# EAGLE schematic pir-sensors-with-esp (EAGLE 9.3.0)
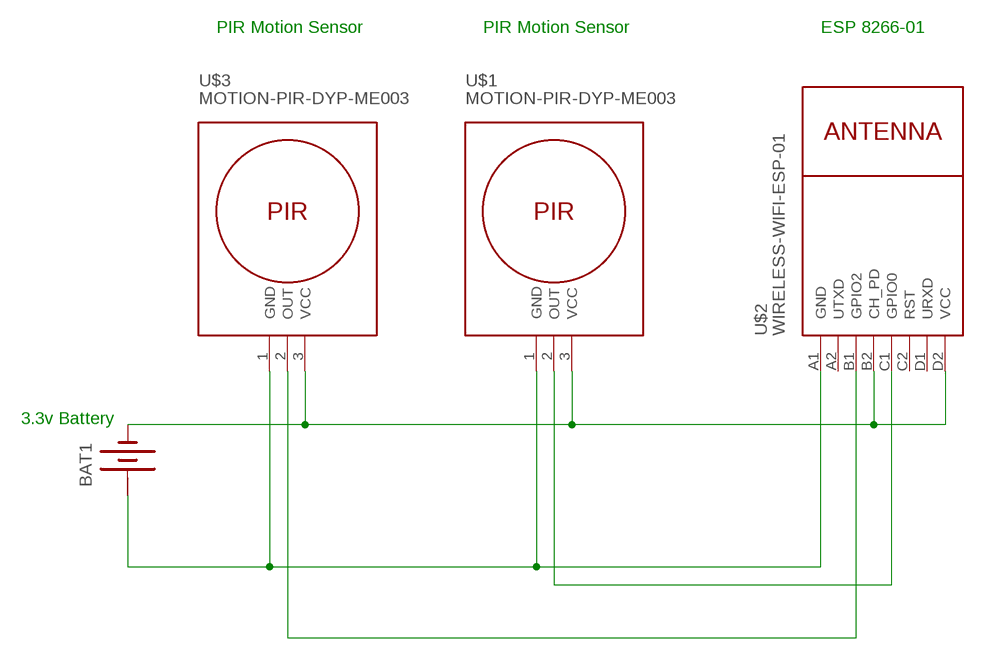
[diagram p0: schematic, sheet 1]

## Parts
BAT1  BATTERY  [BATTERY]
U$1  MOTION-PIR-DYP-ME003  [MOTION-PIR-DYP-ME003]
U$2  WIRELESS-WIFI-ESP-01  [WIRELESS-WIFI-ESP-01]
U$3  MOTION-PIR-DYP-ME003  [MOTION-PIR-DYP-ME003]

## Nets
N$1: U$2.B1(GPIO2) U$3.2(OUT)
N$2: U$1.2(OUT) U$2.C1(GPIO0)
N$3: BAT1.+ U$1.1(GND) U$2.A1(GND) U$3.1(GND)
N$4: BAT1.- U$1.3(VCC) U$2.B2(CH_PD) U$2.D2(VCC) U$3.3(VCC)
Unconnected: U$2.A2(UTXD) U$2.C2(RST) U$2.D1(URXD)

## Notes on the sheet
- PIR Motion Sensor | PIR Motion Sensor | ESP 8266-01
- 3.3v Battery

## Power pins joined to a net without a drawn wire
+: BAT1.+@1(+)

## Library data of the parts
BAT1 = special:BATTERY: BATTERY
U$1 U$3 = diy-modules:MOTION-PIR-DYP-ME003: PIR Motion Sensor Module DYP-ME003 based on BISS0001 pyroelectic detector Click here to find device on ebay.com <http://www.ebay.com/sch/dyp+me003>
U$2 = diy-modules:WIRELESS-WIFI-ESP-01: Wireless Wi-Fi ESP-01 Module based on ESP8266 chip Click here to find device on ebay.com <http://www.ebay.com/sch/esp8266+esp+01+transceiver>